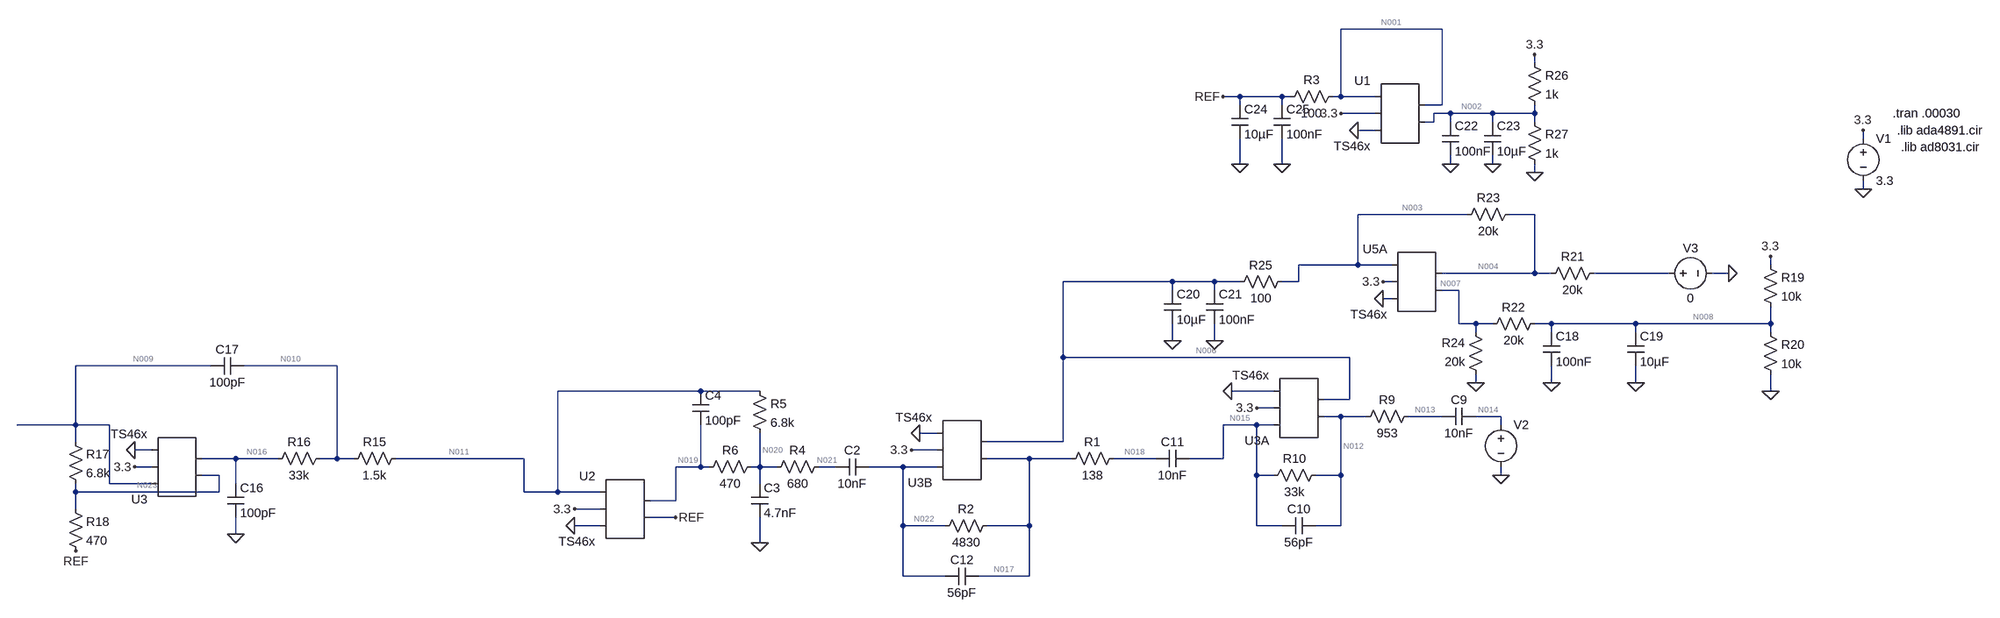
[diagram p0: schematic Schematic.asc]
* Schematic.asc
V2 N014 0 SINE(0 10uV 77.5k 0 0 0 20)
C9 N014 N013 10nF
R9 N013 N012 953
* U3A: TS46x (symbol AutoGenerated\TS46x not available, pins judged from their places): pin1=N012 pin2=N006 pin3=N015 pin4=3.3 pin5=0
R10 N012 N015 33k
C10 N012 N015 56pF
* U3B: TS46x (symbol AutoGenerated\TS46x not available, pins judged from their places): pin1=N017 pin2=N006 pin3=N022 pin4=3.3 pin5=0
R1 N018 N017 138
R2 N017 N022 4830
C12 N017 N022 56pF
R21 N005 N004 20k
V3 N005 0 0
R23 N004 N003 20k
V1 3.3 0 3.3
C18 N008 0 100nF
C19 N008 0 10µF
R22 N008 N007 20k
R24 0 N007 20k
R19 3.3 N008 10k
R20 N008 0 10k
R27 N002 0 1k
R26 3.3 N002 1k
C25 REF 0 100nF
C24 REF 0 10µF
C22 N002 0 100nF
C23 N002 0 10µF
* U5A: TS46x (symbol AutoGenerated\TS46x not available, pins judged from their places): pin1=N004 pin2=N007 pin3=N003 pin4=3.3 pin5=0
R15 N011 N010 1.5k
R16 N010 N016 33k
C16 N016 0 100pF
C17 N010 N009 100pF
R18 N023 REF 470
R17 N009 N023 6.8k
R25 N003 N006 100
C21 N006 0 100nF
C20 N006 0 10µF
C11 N015 N018 10nF
C2 N022 N021 10nF
R4 N021 N020 680
C3 N020 0 4.7nF
R5 N011 N020 6.8k
C4 N011 N019 100pF
R6 N020 N019 470
* U1: TS46x (symbol AutoGenerated\TS46x not available, pins judged from their places): pin1=N001 pin2=N002 pin3=N001 pin4=3.3 pin5=0
R3 N001 REF 100
* U2: TS46x (symbol AutoGenerated\TS46x not available, pins judged from their places): pin1=N019 pin2=REF pin3=N011 pin4=3.3 pin5=0
* U3: TS46x (symbol AutoGenerated\TS46x not available, pins judged from their places): pin1=N023 pin2=N016 pin3=N009 pin4=3.3 pin5=0
.tran .00030
.lib ada4891.cir
.lib ad8031.cir
.backanno
.end

* Results of the author's LTspice run, read from the files saved beside the schematic
* Operating Point, zero values left out:
*   V(n013) = 1.466 V
*   V(n012) = 1.466 V
*   V(n015) = 1.474 V
*   V(n006) = 1.465 V
*   V(3.3) = 3.3 V
*   V(n022) = 1.467 V
*   V(n017) = 1.466 V
*   V(n018) = 1.466 V
*   V(n004) = 732.4 mV
*   V(n003) = 1.465 V
*   V(n008) = 1.467 V
*   V(n007) = 733.3 mV
*   V(n002) = 1.65 V
*   V(ref) = 1.65 V
*   V(n011) = 1.653 V
*   V(n010) = 1.652 V
*   V(n016) = 1.644 V
*   V(n009) = 1.58 V
*   V(n023) = 1.645 V
*   V(n021) = 1.651 V
*   V(n020) = 1.651 V
*   V(n019) = 1.651 V
*   V(n001) = 1.651 V
*   I(R3) = 10.14 µA
*   I(R6) = 249.6 nA
*   I(R5) = 249.6 nA
*   I(R25) = 499.3 nA
*   I(R17) = -9.64 µA
*   I(R18) = -9.889 µA
*   I(R16) = 249.6 nA
*   I(R15) = 249.6 nA
*   I(R26) = 1.65 mA
*   I(R27) = 1.65 mA
*   I(R20) = 146.7 µA
*   I(R19) = 183.3 µA
*   I(R24) = -36.67 µA
*   I(R22) = 36.67 µA
*   I(R23) = -36.62 µA
*   I(R21) = -36.62 µA
*   I(R2) = -249.6 nA
*   I(R10) = -249.6 nA
*   I(V1) = -12.63 mA
*   I(V3) = 36.62 µA
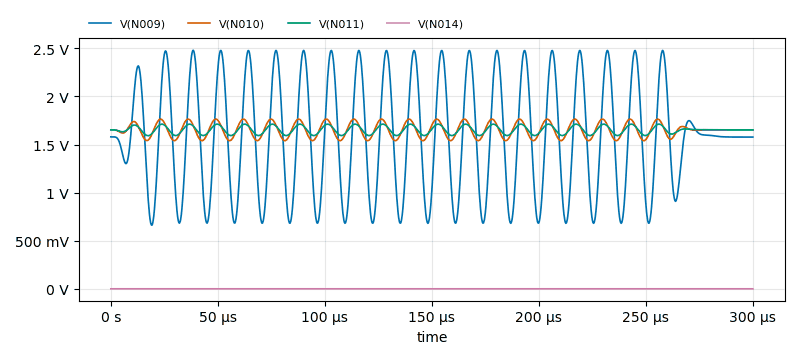
[diagram p1: Transient Analysis of Schematic.asc, plotted from the saved traces]
* Transient Analysis, 1 run:
*   V(N009): min 661.7 mV, max 2.479 V, average 1.58 V, rms 1.685 V, last 1.578 V
*   V(N010): min 1.541 V, max 1.764 V, average 1.652 V, rms 1.654 V, last 1.652 V
*   V(N011): min 1.592 V, max 1.712 V, average 1.653 V, rms 1.653 V, last 1.653 V
*   V(N014): min -10 µV, max 10 µV, average -44.08 pV, rms 6.558 µV, last 0 V